# EAGLE design usbtinyisp v2.0 SS (EAGLE 6.2)
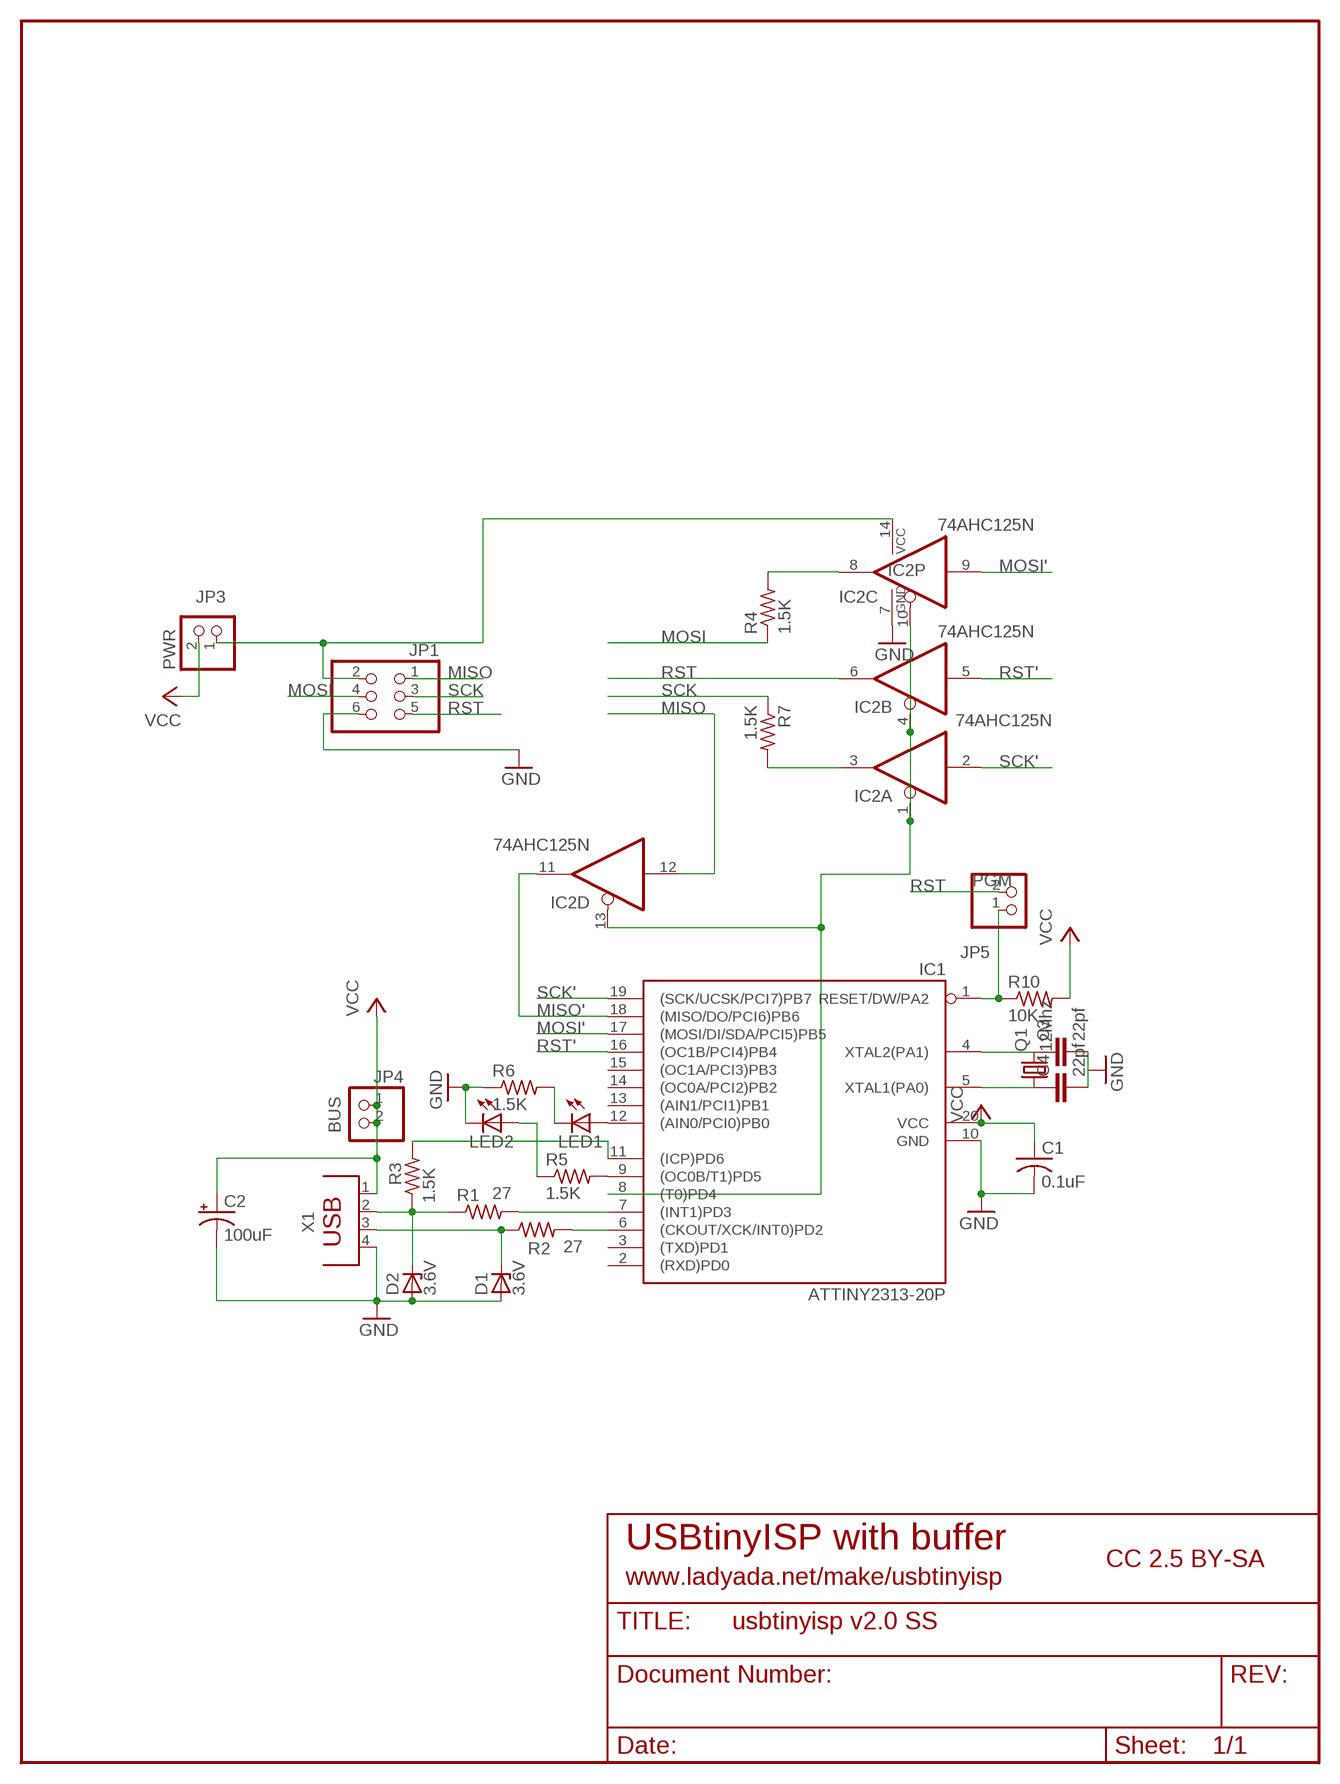
[diagram p0: schematic, sheet 1]

## Parts
C1  0.1uF  C-US025-025X050  [C025-025X050]
C2  100uF  CPOL-USE2.5-5  [E2,5-5]
C3  22pf  C-EU025-025X050  [C025-025X050]
C4  22pf  C-EU025-025X050  [C025-025X050]
D1  3.6V  ZENER-DIODEDO35Z10  [DO35Z10]
D2  3.6V  ZENER-DIODEDO35Z10  [DO35Z10]
IC1  ATTINY2313-20P  [DIL20]
IC2  74AHC125N  74HC125N  [DIL14]
JP1  PINHD-2X3  [2X03]
JP3  PWR  PINHD-1X2  [1X02]
JP4  BUS  PINHD-1X2  [1X02]
JP5  PGM  PINHD-1X2  [1X02]
LED1  LED3MM  [LED3MM]
LED2  LED3MM  [LED3MM]
Q1  12Mhz  CRYSTALHC49S  [HC49/S]
R1  27  R-US_0207/10  [0207/10]
R2  27  R-US_0207/7  [0207/7]
R3  1.5K  R-US_0207/5V  [0207/5V]
R4  1.5K  R-US_0207/10  [0207/10]
R5  1.5K  R-US_0207/5V  [0207/5V]
R6  1.5K  R-US_0207/5V  [0207/5V]
R7  1.5K  R-US_0204/5  [0204/5]
R10  10K  R-US_0207/10  [0207/10]
X1  PN61729  [PN61729]

## Nets
GND: C1.2 C2.- C3.2 C4.2 D1.A D2.A IC1.10(GND) IC2.7(P:GND) JP1.6 LED2.K(C) R6.1 X1.4
MISO: IC2.12(D:I) JP1.1
MISO': IC1.18((MISO/DO/PCI6)PB6) IC2.11(D:O)
MOSI: JP1.4 R4.1
MOSI': IC1.17((MOSI/DI/SDA/PCI5)PB5) IC2.9(C:I)
N$1: D2.C R1.1 R3.1 X1.2
N$2: D1.C R2.1 X1.3
N$3: IC1.7((INT1)PD3) R1.2
N$6: IC1.6((CKOUT/XCK/INT0)PD2) R2.2
N$7: IC1.12((AIN0/PCI0)PB0) LED1.A
N$8: LED1.K(C) R6.2
N$9: IC1.1(RESET/DW/PA2) JP5.1 R10.1
N$10: IC1.9((OC0B/T1)PD5) R5.2
N$11: LED2.A R5.1
N$12: IC2.3(A:O) R7.2
N$13: IC2.8(C:O) R4.2
N$14: IC2.14(P:VCC) JP1.2 JP3.1
N$15: IC1.8((T0)PD4) IC2.1(A:OE) IC2.4(B:OE) IC2.10(C:OE) IC2.13(D:OE)
N$16: IC1.11((ICP)PD6) R3.2
N$17: C3.1 IC1.4(XTAL2(PA1)) Q1.2
N$18: C4.1 IC1.5(XTAL1(PA0)) Q1.1
RST: IC2.6(B:O) JP1.5 JP5.2
RST': IC1.16((OC1B/PCI4)PB4) IC2.5(B:I)
SCK: JP1.3 R7.1
SCK': IC1.19((SCK/UCSK/PCI7)PB7) IC2.2(A:I)
VCC: C1.1 C2.+ IC1.20(VCC) JP3.2 JP4.1 JP4.2 R10.2 X1.1
Unconnected: IC1.2((RXD)PD0) IC1.3((TXD)PD1) IC1.13((AIN1/PCI1)PB1) IC1.14((OC0A/PCI2)PB2) IC1.15((OC1A/PCI3)PB3)

## Notes on the sheet
- USBtinyISP with buffer
- CC 2.5 BY-SA
- www.ladyada.net/make/usbtinyisp

## Library data of the parts
C1 = rcl-ez:C-US: CAPACITOR, American symbol
C2 = rcl-ez:CPOL-US: POLARIZED CAPACITOR, American symbol
C3 C4 = rcl:C-EU: CAPACITOR, European symbol
D1 D2 = diode:ZENER-DIODE: Z-Diode
IC1 = avr:ATTINY2313: MICROCONTROLLER 2 Kbytes FLASH 128 bytes SRAM 128 bytes EEPROM USART USI
IC2 = 74xx-eu:74*125: Quad bus BUFFER, 3-state
JP1 = pinhead-ez:PINHD-2X3: PIN HEADER
JP3-JP5 = pinhead:PINHD-1X2: PIN HEADER
LED1 LED2 = minimidi:LED: LED OSRAM: - CHIPLED LG R971, LG N971, LY N971, LG Q971, LY Q971, LO R971, LY R971 LH N974, LH R974 LS Q976, LO Q976, LY Q976 LO Q996 - Hyper CHIPLED LW Q18S LB Q993, LB Q99A, LB R99A - SideLED LS A670, LO A670, LY A670, LG A670, LP A670 LB A673, LV A673, LT A673, LW A673 LH A674 LY A675 LS A676, LA A676, LO A676, LY A676, LW A676 LS A679, LY A679, LG A679 - Hyper Micro SIDELED® LS Y876, LA Y876, LO Y876, LY Y876 LT Y87S - SmartLED LW L88C, LW L88S LB L89C, LB L89S, LG L890 LS L89K, LO L89K, LY L89K LS L896, LA L896, LO L896, LY L896 - TOPLED LS T670, LO T670, LY T670, LG T670, LP T670 LSG T670, LSP T670, LSY T670, LOP T670, LYG T670 LG T671, LOG T671, LSG T671 LB T673, LV T673, LT T673, LW T673 LH T674 LS T676, LA T676, LO T676, LY T676, LB T676, LH T676, LSB T676, LW T676 LB T67C, LV T67C, LT T67C, LS T67K, LO T67K, LY T67K, LW E67C LS E67B, LA E67B, LO E67B, LY E67B, LB E67C, LV E67C, LT E67C LW T67C LS T679, LY T679, LG T679 LS T770, LO T770, LY T770, LG T770, LP T770 LB T773, LV T773, LT T773, LW T773 LH T774 LS E675, LA E675, LY E675, LS T675 LS T776, LA T776, LO T776, LY T776, LB T776 LHGB T686 LT T68C, LB T68C - Hyper Mini TOPLED® LB M676 - Mini TOPLED Santana® LG M470 LS M47K, LO M47K, LY M47K Source: http://www.osram.convergy.de/
Q1 = crystal:CRYSTAL: CRYSTAL
R1-R7 R10 = rcl-ez:R-US_: RESISTOR, American symbol
X1 = con-berg-ez:PN61729: BERG USB connector

## Board
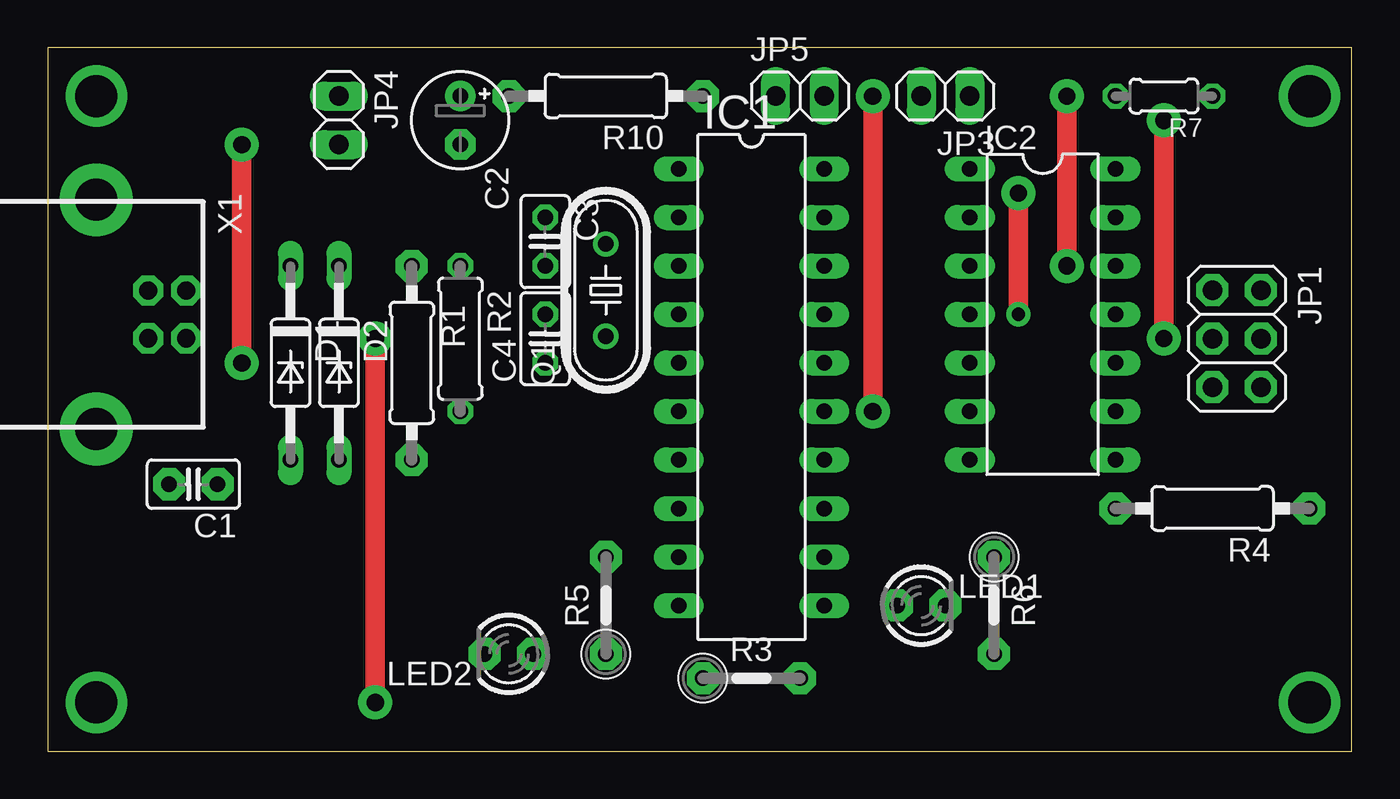
[diagram p1: board, top side]
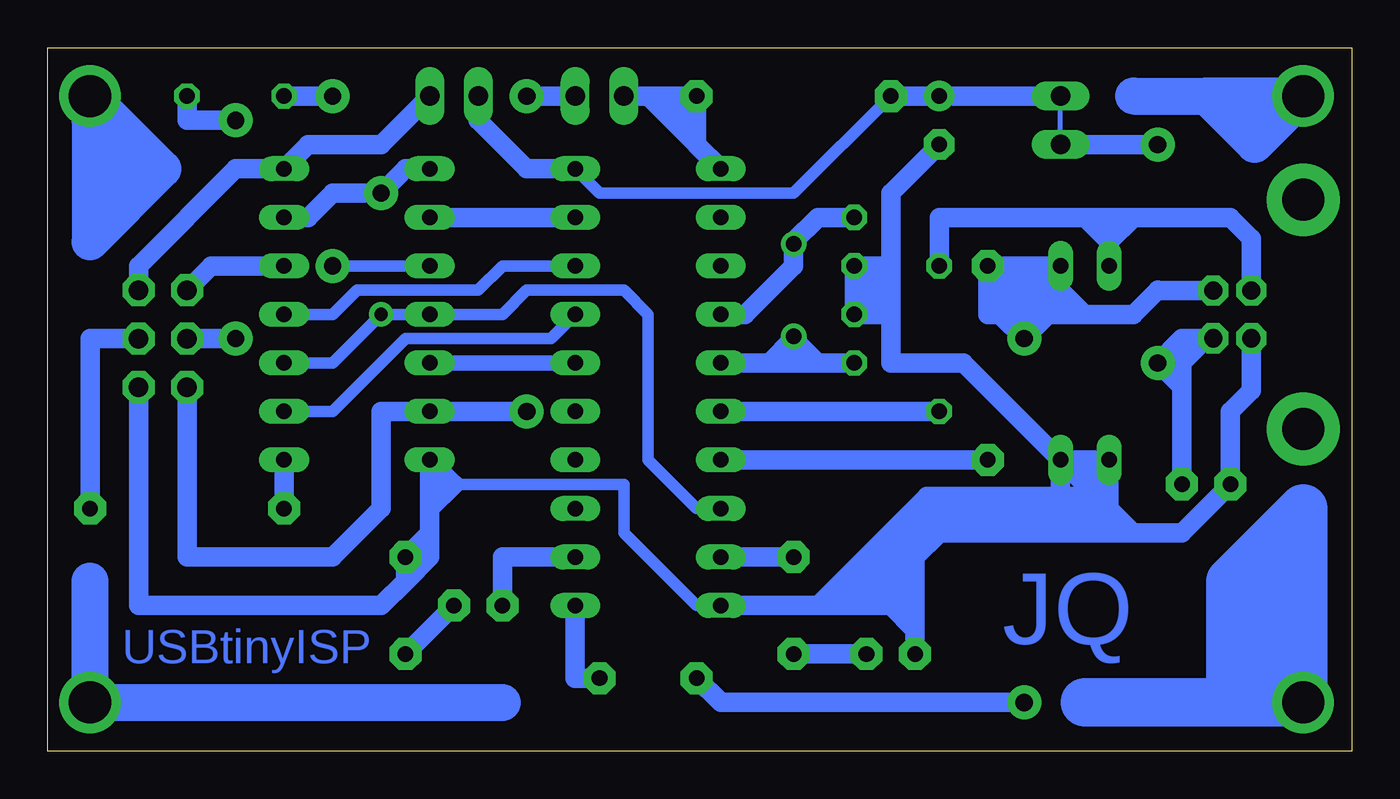
[diagram p2: board, bottom side, seen from below]

Size 68.25 x 36.82 mm. Coordinates in mm from the lower left corner, seen from the top.
Outline: 0,0 68.25,0 68.25,36.82 0,36.82 0,0
Copper layers (1*16): Top 0.035mm / dielectric 1.5mm / Bottom 0.035mm
Design rules: minimum track width 10mil, minimum drill 24mil, track to track 8mil, track to pad 8mil, pad to pad 8mil, via to via 8mil, smd to smd 8mil, copper to edge 40mil, drill to drill 8mil, minimum pad ring 10mil, minimum via ring 8mil, stop-mask expansion 4mil, vias tented up to drill 0mil, thermal gap 10mil

### Footprints (pad centres in the part's own frame; a part is rotated, then mirrored left to right if it is on the bottom)
C025-025X050 = drill 0.813 pad 1.676 octagon: 1 -1.27,0; 2 1.27,0
E2,5-5 = drill 0.813 pad 1.6: + -1.27,0 | drill 0.813 pad 1.6 octagon: - 1.27,0
C025-025X050' = drill 0.813 octagon: 1 -1.27,0; 2 1.27,0
DO35Z10 = drill 0.813 long: A 5.08,0; C -5.08,0
DIL20 = drill 0.813 long: 1 -11.43,-3.81; 2 -8.89,-3.81; 3 -6.35,-3.81; 4 -3.81,-3.81; 5 -1.27,-3.81; 6 1.27,-3.81; 7 3.81,-3.81; 8 6.35,-3.81; 9 8.89,-3.81; 10 11.43,-3.81; 11 11.43,3.81; 12 8.89,3.81; 13 6.35,3.81; 14 3.81,3.81; 15 1.27,3.81; 16 -1.27,3.81; 17 -3.81,3.81; 18 -6.35,3.81; 19 -8.89,3.81; 20 -11.43,3.81
DIL14 = drill 0.813 long: 1 -7.62,-3.81; 2 -5.08,-3.81; 3 -2.54,-3.81; 4 0,-3.81; 5 2.54,-3.81; 6 5.08,-3.81; 7 7.62,-3.81; 8 7.62,3.81; 9 5.08,3.81; 10 2.54,3.81; 11 0,3.81; 12 -2.54,3.81; 13 -5.08,3.81; 14 -7.62,3.81
2X03 = drill 1.016 pad 1.676 octagon: 1 -2.54,-1.27; 2 -2.54,1.27; 3 0,-1.27; 4 0,1.27; 5 2.54,-1.27; 6 2.54,1.27
1X02 = drill 1.016 long: 1 -1.27,0; 2 1.27,0
LED3MM = drill 0.813 pad 1.676 octagon: A -1.27,0; K 1.27,0
HC49/S = drill 0.813: 1 -2.413,0; 2 2.413,0
0207/10 = drill 0.813 pad 1.676 octagon: 1 -5.08,0; 2 5.08,0
0207/7 = drill 0.813 octagon: 1 -3.81,0; 2 3.81,0
0207/5V = drill 0.813 pad 1.676 octagon: 1 -2.54,0; 2 2.54,0
0204/5 = drill 0.813 octagon: 1 -2.54,0; 2 2.54,0
PN61729 = drill 0.95 pad 1.575 octagon: 1 1.25,4.71; 2 -1.25,4.71; 3 -1.25,2.71; 4 1.25,2.71 | drill 2.2 pad 3.81: P$1 -6,0; P$2 6,0

### Placement (x,y rotation side)
C1  7.62,13.97 180 top
C2  21.59,33.02 270 top
C3  22pf  [C025-025X050']  26.04,26.67 270 top
C4  22pf  [C025-025X050']  26.04,21.59 90 top
D1  12.7,20.32 270 top
D2  15.24,20.32 270 top
IC1  36.83,19.05 270 top
IC2  52.07,22.86 270 top
JP1  62.23,21.59 270 top
JP3  46.99,34.29 180 top
JP4  15.24,33.02 270 top
JP5  39.37,34.29 0 top
LED1  45.72,7.62 0 top
LED2  24.13,5.08 180 top
Q1  29.21,24.13 90 top
R1  19.05,20.32 270 top
R2  21.59,21.59 270 top
R3  36.83,3.81 0 top
R4  60.96,12.7 180 top
R5  29.21,7.62 90 top
R6  49.53,7.62 270 top
R7  58.42,34.29 180 top
R10  29.21,34.29 180 top
X1  2.54,22.86 270 top

### Tracks (layer width: path | path; a pad name or v marks a point on that pad's centre or on a via)
GND
  Bottom 0.61: IC1.10 34.29,7.62 38.1,11.43 38.1,13.97 46.99,13.97 48.26,13.97
  Bottom 1.016: R6.1 49.53,8.89 | 48.26,10.16 R6.1 | 48.26,12.7 48.26,13.97 IC2.7 46.99,13.97 48.26,12.7 | 48.26,12.7 48.26,11.43 | 48.26,11.43 48.26,10.16 | 22.86,10.16 22.86,8.89 | 22.86,8.89 22.86,7.62 | 22.86,7.62 22.86,6.35 | 22.86,6.35 LED2.K | 22.86,10.16 21.59,11.43 13.97,11.43 | 13.97,15.24 D1.A 12.7,13.97 | 13.97,15.24 D2.A | 11.43,11.43 8.89,11.43 C1.2 6.35,17.78 5.25,18.88 X1.4 | 11.43,11.43 12.7,11.43 | 12.7,11.43 13.97,11.43 | 22.86,7.62 24.13,7.62 | 24.13,7.62 25.4,7.62 | 25.4,7.62 26.67,7.62 | 26.67,7.62 27.94,7.62 | 27.94,7.62 IC1.10 | 12.7,11.43 12.7,12.7 | C2.- 24.13,29.21 24.13,25.4 | 24.13,22.86 24.13,20.32 20.32,20.32 D2.A | 24.13,23.5 24.13,24.13 | 24.13,24.13 24.13,24.77 | JP1.6 63.5,7.62 50.8,7.62 49.53,8.89 | 26.04,24.13 26.04,24.77 | 26.04,24.77 C3.2 24.13,25.4 | 26.04,23.5 26.04,24.13 | 26.04,23.5 C4.2 24.13,22.86 | 24.13,24.13 26.04,24.13 | 48.26,10.16 49.53,8.89 | 48.26,11.43 R6.1 | 24.13,24.77 24.13,25.4 | 24.13,24.77 26.04,24.77 | 26.04,23.5 26.04,24.77 | 24.13,23.5 26.04,23.5 | 24.13,22.86 24.13,23.5 | 13.97,13.97 D2.A | 12.7,12.7 13.97,13.97 | 12.7,12.7 12.7,13.97 | 12.7,13.97 13.97,15.24 | 12.7,12.7 13.97,11.43 | 11.43,11.43 12.7,12.7 | 13.97,13.97 13.97,13.34 | 13.97,13.34 13.97,12.7 13.97,11.43 | 22.86,8.89 24.13,7.62 | 24.13,7.62 22.86,6.35 | 22.86,10.16 25.4,7.62 | 25.4,8.89 26.67,7.62 | 27.94,7.62 22.23,13.34 15.24,13.34 | 15.24,13.34 13.97,13.34 | D2.A 15.24,13.34
  Bottom 1.93: 13.97,12.7 21.59,12.7 25.4,8.89
MISO
  Bottom 1.016: JP1.1 59.69,25.4 IC2.12
MISO'
  Bottom 0.61: IC2.11 53.34,22.86 52.07,24.13 45.72,24.13 44.45,25.4 IC1.18
MOSI
  Bottom 1.016: JP1.4 66.04,21.59 R4.1
MOSI'
  Bottom 0.61: IC2.9 53.34,17.78 49.53,21.59 41.91,21.59 IC1.17
N$1  (via drill 0.9 pad 1.78)
  Top 1.016: v17.14,2.54 v17.14,21.59
  Bottom 1.016: 17.14,25.4 16.51,25.4 | 15.88,25.4 16.51,25.4 | 15.88,25.4 D2.C 15.24,24.13 | 15.24,22.86 15.24,24.13 | 15.24,22.86 13.97,22.86 | 13.97,22.86 11.43,22.86 10.16,24.13 10.14,24.11 X1.2 | v17.14,21.59 17.14,25.4 | v17.14,2.54 33.02,2.54 R3.1 | 16.51,22.86 17.78,22.86 | 18.41,22.86 17.78,22.86 | 18.41,22.86 19.05,22.86 R1.1 18.41,25.4 | 18.41,25.4 17.78,25.4 | 17.14,25.4 17.78,25.4 | v17.14,21.59 18.41,22.86 | v17.14,21.59 15.88,22.86 | 16.51,22.86 16.51,25.4 | 15.88,22.86 16.51,22.86 | 15.88,22.86 15.24,22.86 | 15.88,22.86 15.88,25.4 | 17.78,22.86 17.78,25.4 | 18.41,22.86 18.41,25.4 | 15.24,24.13 13.97,22.86
N$2
  Bottom 1.016: X1.3 5.25,26.84 6.35,27.94 11.43,27.94 | 11.43,27.94 12.7,27.94 | 12.7,27.94 12.7,26.67 | 12.7,26.67 D1.C | R2.1 21.59,27.94 13.97,27.94 | 12.7,27.94 13.97,27.94 | 12.7,26.67 13.97,27.94 | 11.43,27.94 12.7,26.67
N$3
  Bottom 1.016: R1.2 IC1.7
N$4  (via drill 2.2 pad 2.54)
  Bottom 1.93: v2.54,34.29 7.62,34.29 | 11.43,34.29 7.62,34.29 | 7.62,34.29 5.08,31.75 v2.54,34.29 | v2.54,34.29 3.81,34.29 5.08,33.02
N$5  (via drill 2.2 pad 2.54)
  Bottom 1.93: v66.04,34.29 66.04,26.67 62.23,30.48 v66.04,34.29 | v66.04,34.29 66.04,33.02 63.5,30.48 64.77,30.48 64.77,29.21
N$6
  Bottom 1.016: R2.2 IC1.6
N$7
  Bottom 1.016: LED1.A 44.45,10.16 IC1.12
N$8
  Bottom 1.016: LED1.K R6.2
N$9
  Bottom 1.016: 35.56,34.29 R10.1 34.29,33.02 | 36.83,34.29 35.56,34.29 | 36.83,34.29 JP5.1 | 34.29,31.75 34.29,33.02 | IC1.1 34.29,31.75 | 34.29,33.02 35.56,34.29 | 34.29,31.75 36.83,34.29
N$10
  Bottom 1.016: R5.2 IC1.9
N$11
  Bottom 1.016: LED2.A R5.1
N$12  (via drill 0.9 pad 1.78)
  Top 1.016: v53.34,25.4 v53.34,34.29
  Bottom 0.61: IC2.3 v53.34,25.4
  Bottom 1.016: v53.34,34.29 R7.2
N$13
  Bottom 1.016: R4.2 IC2.8
N$14
  Bottom 1.016: JP1.2 63.5,25.4 58.42,30.48 IC2.14 54.61,31.75 50.8,31.75 JP3.1
N$15  (via drill 0.7 pad 1.27, 0.9 pad 1.78)
  Top 1.016: v50.8,22.86 v50.8,29.21
  Bottom 0.254: IC2.10 54.61,20.32
  Bottom 0.61: IC2.10 53.34,20.32 v50.8,22.86 IC2.4 44.45,22.86 43.18,24.13 38.1,24.13 36.83,22.86 36.83,15.24 34.29,12.7 IC1.8
  Bottom 1.016: IC2.1 49.53,30.48 v50.8,29.21 53.34,29.21 54.61,27.94 IC2.13
N$16
  Bottom 1.016: IC1.11 40.64,3.81 R3.2
N$17
  Bottom 1.016: IC1.4 31.75,22.86 29.21,25.4 Q1.2 29.21,26.67 27.94,27.94 C3.1
N$18
  Bottom 1.016: C4.1 27.94,20.32 | 27.94,20.32 29.21,20.32 | 29.21,20.32 30.48,20.32 | 30.48,20.32 IC1.5 | 29.21,20.32 29.21,21.59 | 29.21,21.59 Q1.1 | 27.94,20.32 29.21,21.59 | 29.21,21.59 30.48,20.32
N$19  (via drill 2.2 pad 2.54)
  Bottom 1.93: 66.04,8.89 v66.04,2.54 44.45,2.54
N$20  (via drill 2.2 pad 2.54)
  Bottom 2.54: 3.81,2.54 5.08,2.54 | 5.08,2.54 6.35,2.54 6.35,8.89 2.54,12.7 v2.54,2.54 3.81,2.54 | 3.81,2.54 3.81,8.89 | 5.08,2.54 13.97,2.54
RST  (via drill 0.9 pad 1.78)
  Top 1.016: v43.18,17.78 v43.18,34.29
  Bottom 1.016: v43.18,17.78 IC2.6 50.8,17.78 50.8,12.7 53.34,10.16 60.96,10.16 JP1.5 | v43.18,34.29 JP5.2
RST'
  Bottom 0.813: IC1.16 IC2.5
SCK  (via drill 0.9 pad 1.78)
  Top 1.016: v58.42,21.59 v58.42,33.02
  Bottom 1.016: v58.42,21.59 JP1.3 | R7.1 60.96,33.02 v58.42,33.02
SCK'
  Bottom 1.016: IC1.19 IC2.2
VCC  (via drill 0.9 pad 1.78)
  Top 1.016: v10.16,20.32 v10.16,31.75
  Bottom 0.254: JP4.2 JP4.1
  Bottom 0.61: R10.2 29.21,29.21 39.37,29.21 IC1.20
  Bottom 1.016: C1.1 8.89,19.05 | 8.89,19.05 8.89,20.32 | 8.89,20.32 v10.16,20.32 | v10.16,31.75 JP4.2 | JP3.2 45.72,33.02 43.18,30.48 IC1.20 | X1.1 7.6,21.61 7.62,21.59 | 8.89,20.32 7.62,21.59 | JP4.1 C2.+ R10.2 | 7.62,21.59 8.89,21.59 v10.16,20.32 | 8.89,19.05 v10.16,20.32

### Text on the board
Bottom: JQ | USBtinyISP